# EAGLE design Wheatstone_bridge (EAGLE 9.3.1)
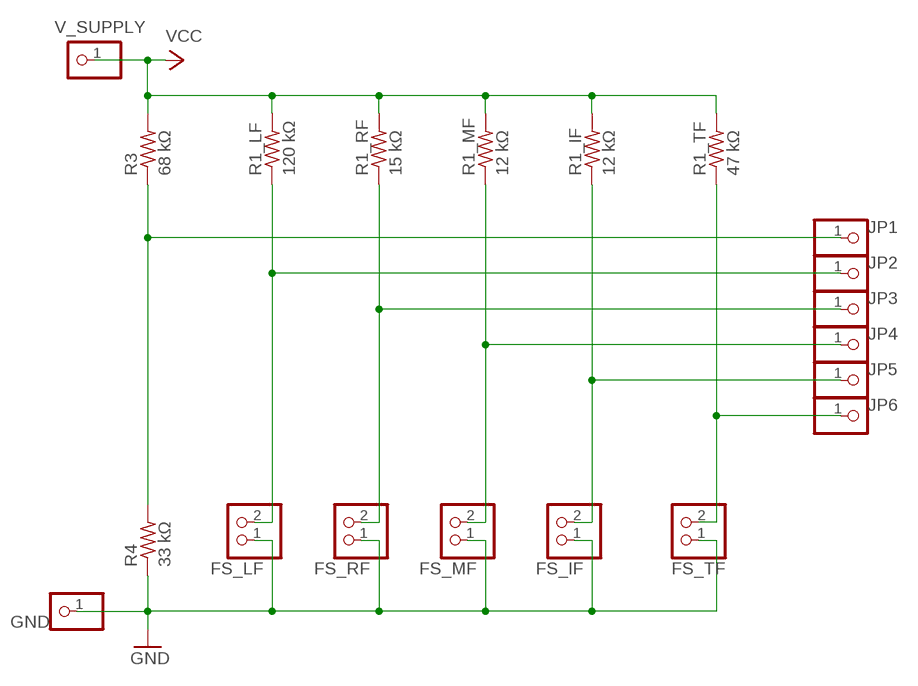
[diagram p0: schematic, sheet 1]

## Parts
FS_IF  PINHD-1X2  [1X02]
FS_LF  PINHD-1X2  [1X02]
FS_MF  PINHD-1X2  [1X02]
FS_RF  PINHD-1X2  [1X02]
FS_TF  PINHD-1X2  [1X02]
GND  PINHD-1X1  [1X01]
JP1  PINHD-1X1  [1X01]
JP2  PINHD-1X1  [1X01]
JP3  PINHD-1X1  [1X01]
JP4  PINHD-1X1  [1X01]
JP5  PINHD-1X1  [1X01]
JP6  PINHD-1X1  [1X01]
R1_IF  12 kΩ  R-US_0207/7  [0207/7]
R1_LF  120 kΩ  R-US_0207/7  [0207/7]
R1_MF  12 kΩ  R-US_0207/7  [0207/7]
R1_RF  15 kΩ  R-US_0207/7  [0207/7]
R1_TF  47 kΩ  R-US_0207/7  [0207/7]
R3  68 kΩ  R-US_0207/7  [0207/7]
R4  33 kΩ  R-US_0207/7  [0207/7]
V_SUPPLY  PINHD-1X1  [1X01]

## Nets
GND: FS_IF.1 FS_LF.1 FS_MF.1 FS_RF.1 FS_TF.1 GND.1 R4.1
N$2: JP1.1 R3.1 R4.2
N$4: FS_LF.2 JP2.1 R1_LF.1
N$6: FS_TF.2 JP6.1 R1_TF.1
N$7: FS_RF.2 JP3.1 R1_RF.1
N$8: FS_MF.2 JP4.1 R1_MF.1
N$9: FS_IF.2 JP5.1 R1_IF.1
VCC: R1_IF.2 R1_LF.2 R1_MF.2 R1_RF.2 R1_TF.2 R3.2 V_SUPPLY.1

## Library data of the parts
FS_IF FS_LF FS_MF FS_RF FS_TF = pinhead:PINHD-1X2: PIN HEADER
GND JP1-JP6 V_SUPPLY = pinhead:PINHD-1X1: PIN HEADER
R1_IF R1_LF R1_MF R1_RF R1_TF R3 R4 = rcl:R-US_: RESISTOR, American symbol; SPICEPREFIX: R

## Board
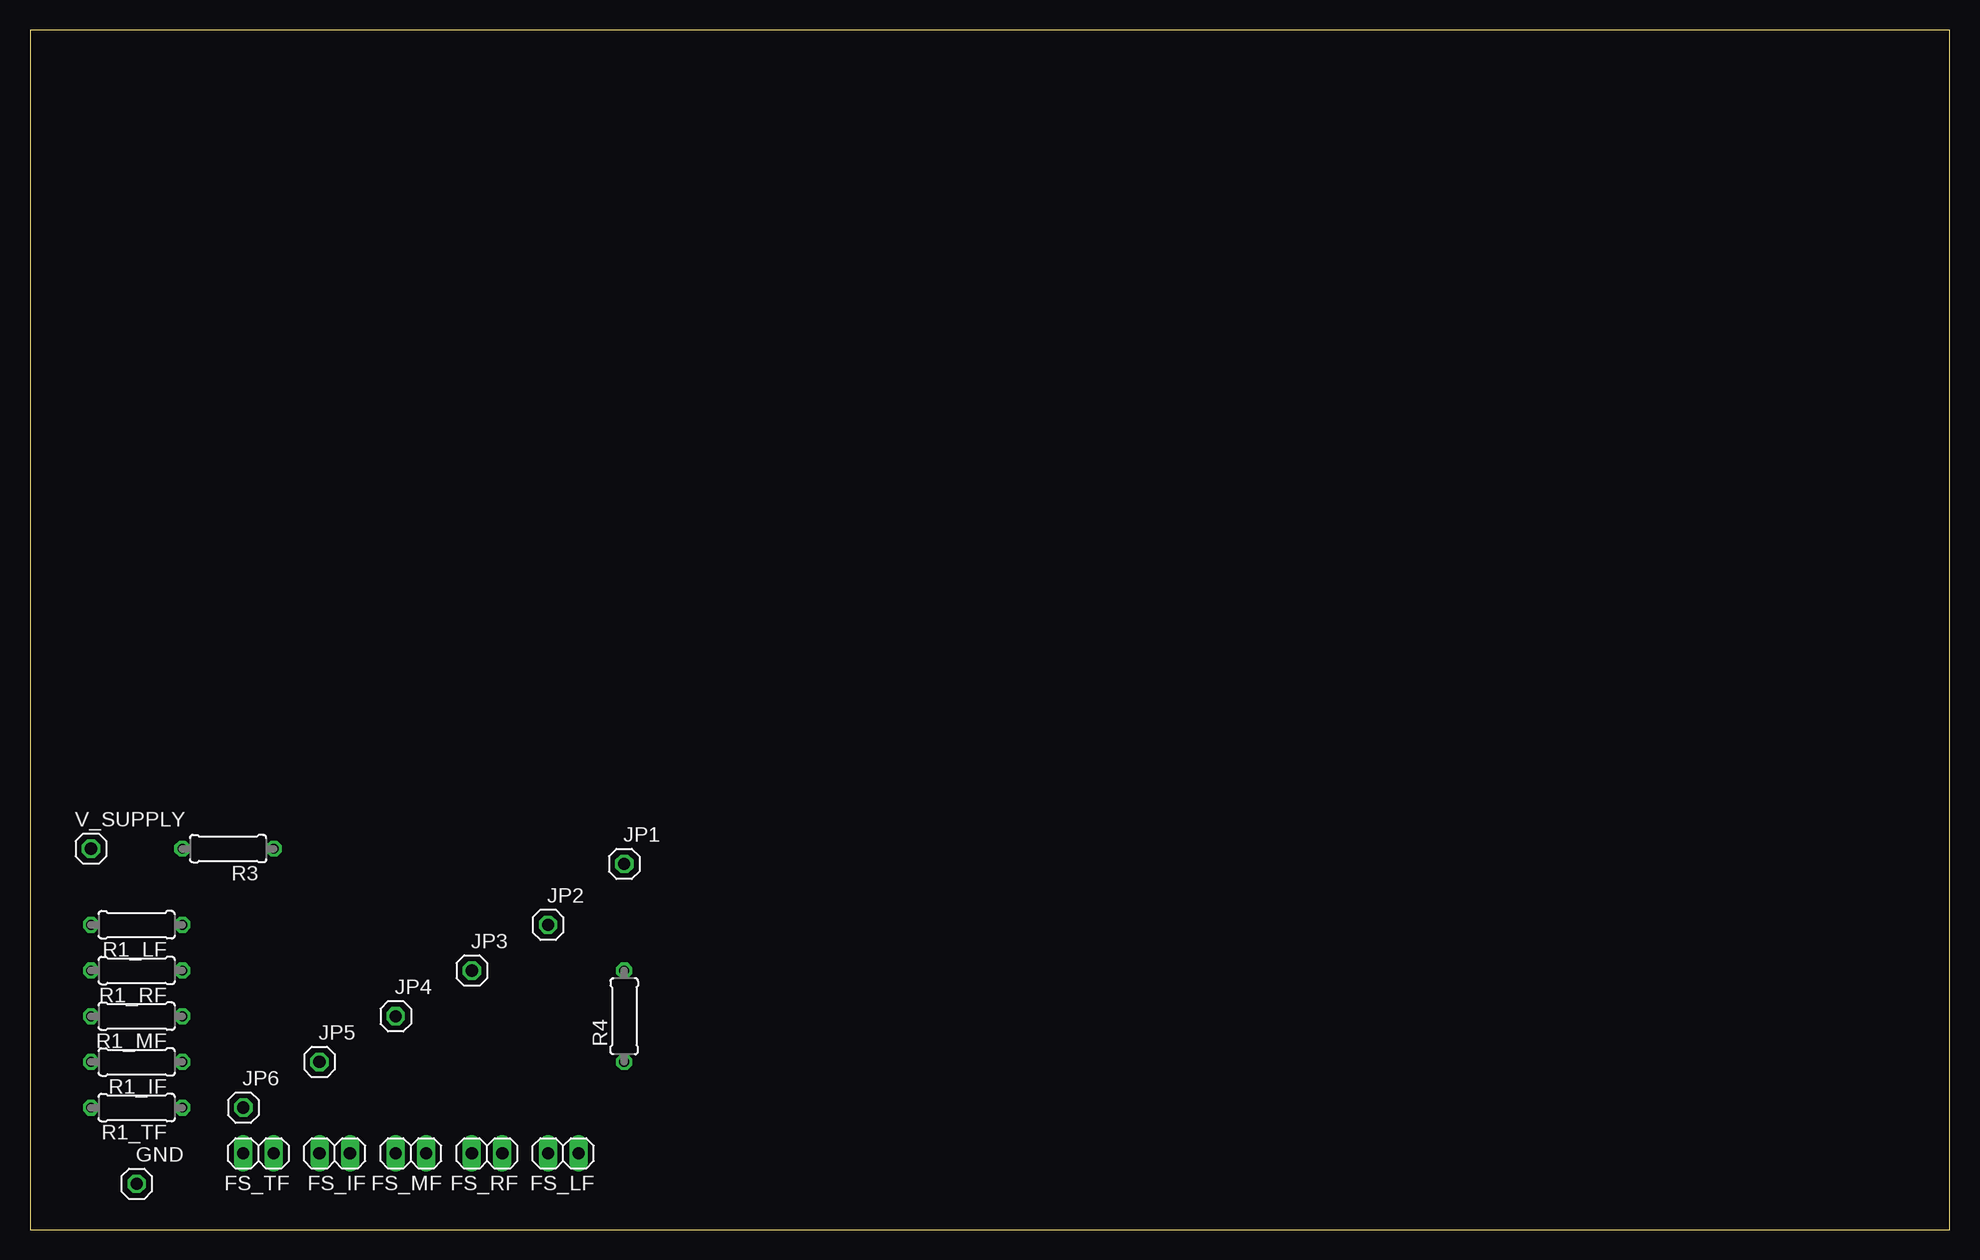
[diagram p1: board, top side]
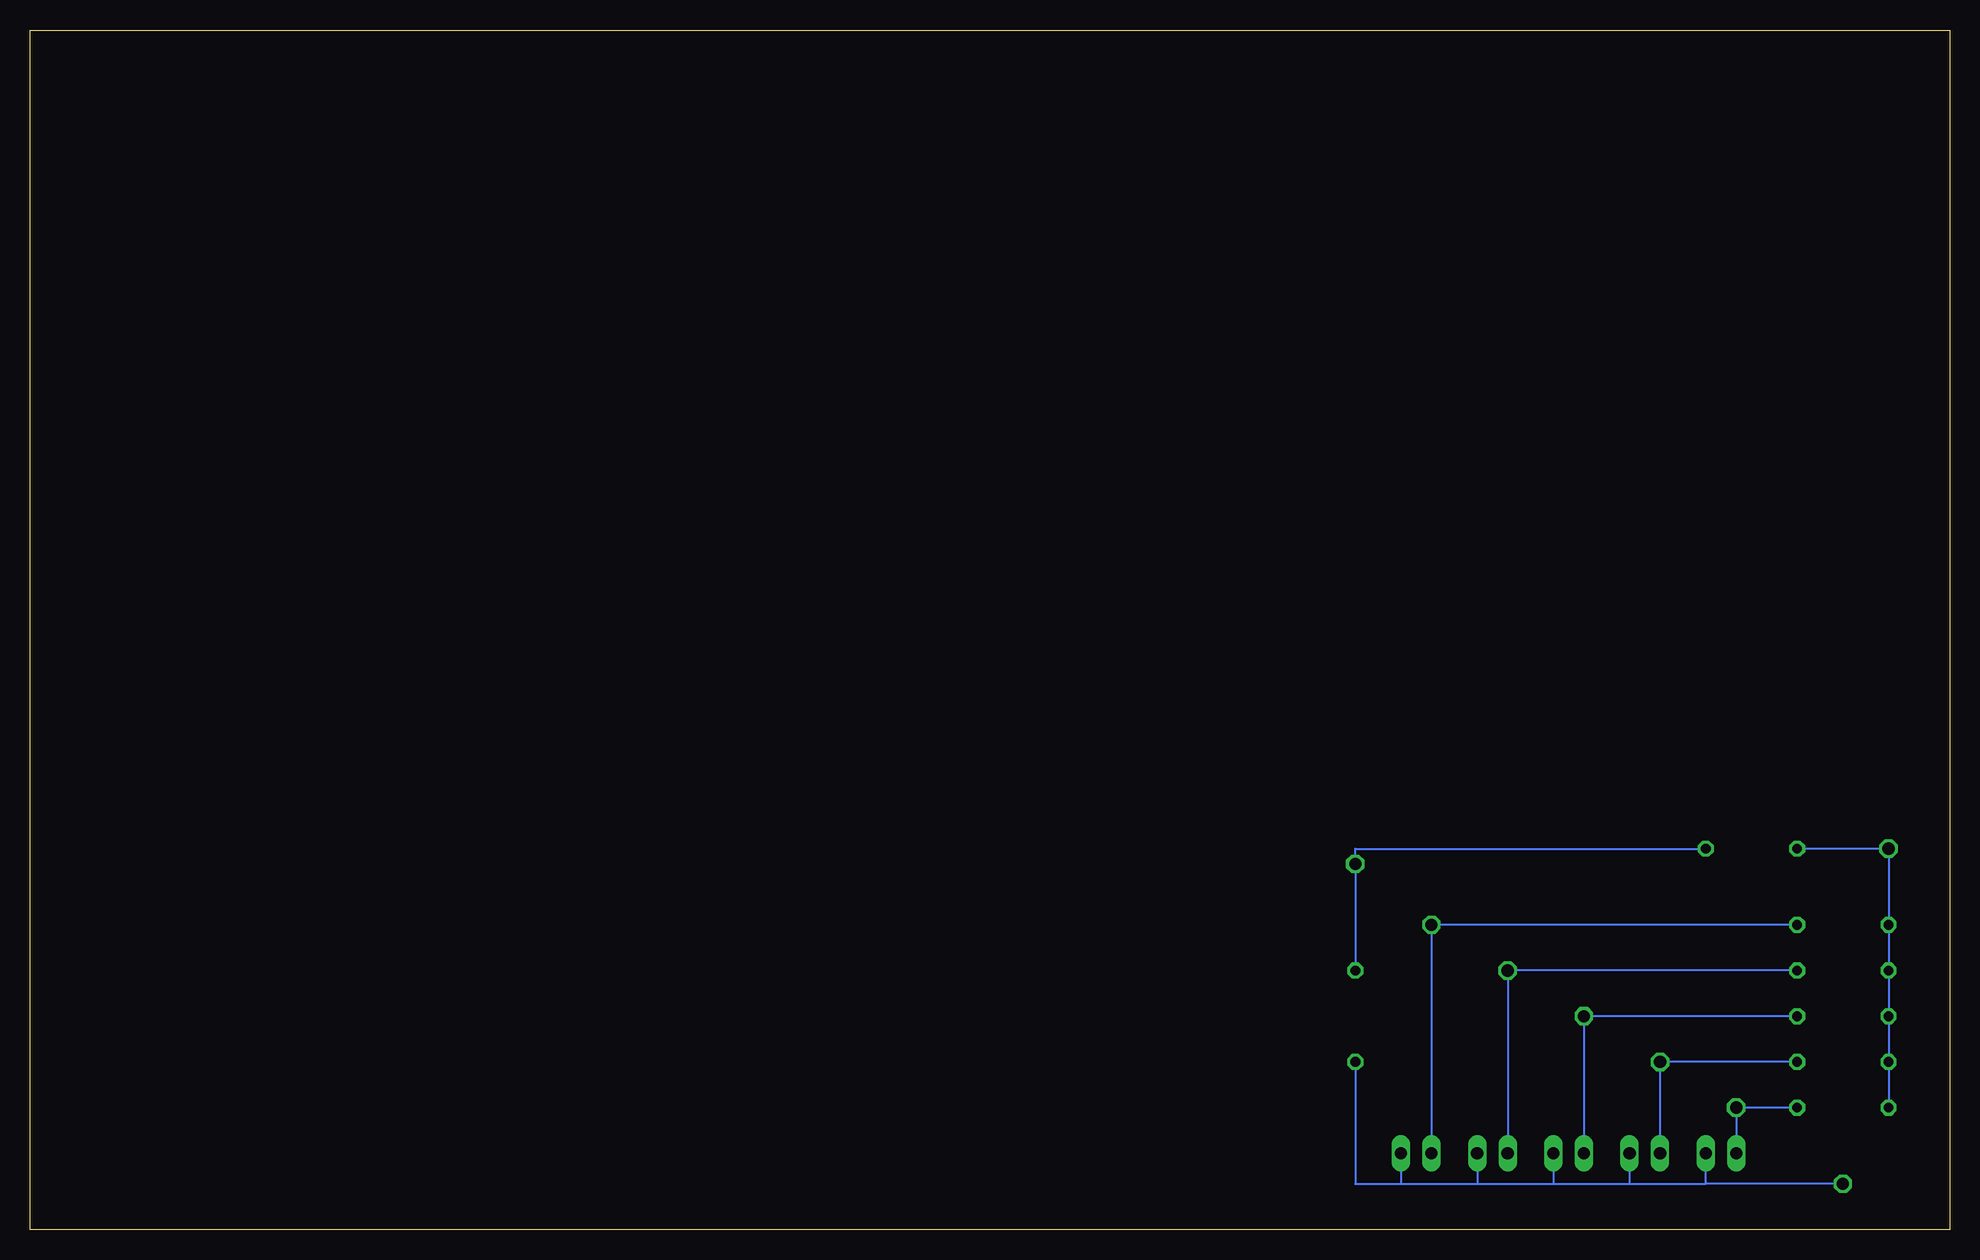
[diagram p2: board, bottom side, seen from below]

Size 160 x 100 mm. Coordinates in mm from the lower left corner, seen from the top.
Outline: 0,0 160,0 160,100 0,100 0,0
Copper layers (1*16): Top 0.035mm / dielectric 1.5mm / Bottom 0.035mm
Design rules "default": minimum track width 6mil, minimum drill 0.35mm, track to track 6mil, track to pad 6mil, pad to pad 6mil, via to via 6mil, smd to smd 6mil, copper to edge 40mil, drill to drill 6mil, minimum pad ring 10mil, minimum via ring 8mil, stop-mask expansion 4mil, vias tented up to drill 0mil, thermal gap 10mil

### Footprints (pad centres in the part's own frame; a part is rotated, then mirrored left to right if it is on the bottom)
1X02 = drill 1.016 long: 1 -1.27,0; 2 1.27,0
1X01 = drill 1.016 octagon: 1 0,0
0207/7 = drill 0.813 octagon: 1 -3.81,0; 2 3.81,0

### Placement (x,y rotation side)
FS_IF  25.4,6.35 180 top
FS_LF  44.45,6.35 180 top
FS_MF  31.75,6.35 180 top
FS_RF  38.1,6.35 180 top
FS_TF  19.05,6.35 180 top
GND  8.89,3.81 0 top
JP1  49.53,30.48 0 top
JP2  43.18,25.4 0 top
JP3  36.83,21.59 0 top
JP4  30.48,17.78 0 top
JP5  24.13,13.97 0 top
JP6  17.78,10.16 0 top
R1_IF  8.89,13.97 180 top
R1_LF  8.89,25.4 180 top
R1_MF  8.89,17.78 180 top
R1_RF  8.89,21.59 180 top
R1_TF  8.89,10.16 180 top
R3  16.51,31.75 180 top
R4  49.53,17.78 90 top
V_SUPPLY  5.08,31.75 0 top

### Tracks (layer width: path | path; a pad name or v marks a point on that pad's centre or on a via)
GND
  Bottom 0.152: GND.1 20.32,3.81 | 20.32,3.81 FS_TF.1 | FS_IF.1 26.67,3.81 | 26.67,3.81 20.32,3.81 | FS_MF.1 33.02,3.81 | 33.02,3.81 26.67,3.81 | FS_RF.1 39.37,3.81 | 39.37,3.81 33.02,3.81 | FS_LF.1 45.72,3.81 | 45.72,3.81 39.37,3.81 | R4.1 49.53,3.81 45.72,3.81
N$2
  Bottom 0.152: R3.1 49.53,31.75 JP1.1 R4.2
N$4
  Bottom 0.152: R1_LF.1 JP2.1 FS_LF.2
N$6
  Bottom 0.152: R1_TF.1 JP6.1 FS_TF.2
N$7
  Bottom 0.152: R1_RF.1 JP3.1 FS_RF.2
N$8
  Bottom 0.152: R1_MF.1 JP4.1 FS_MF.2
N$9
  Bottom 0.152: R1_IF.1 JP5.1 FS_IF.2
VCC
  Bottom 0.152: R1_TF.2 R1_IF.2 R1_MF.2 R1_RF.2 R1_LF.2 V_SUPPLY.1 R3.2